# Altium schematic sheet Power_Regulators_RF_3.SchDoc
size A4; DocumentNumber: 37; SheetNumber: 37; SheetTotal: 47
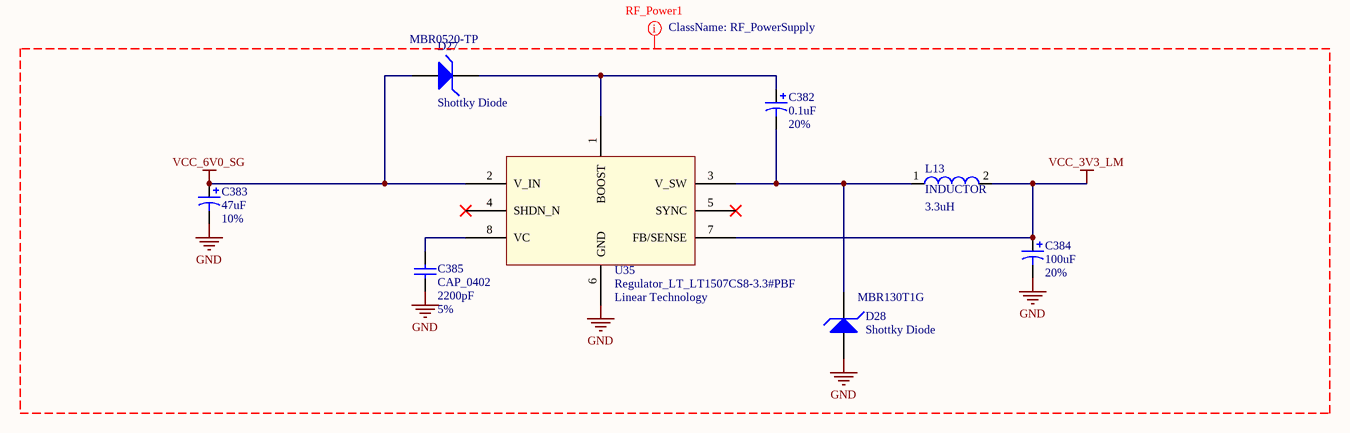
[diagram p0: Power_Regulators_RF_3.SchDoc]

## Parts
C382  value 0.1uF  Tolerance: 20%  [Polarized_CAPC1206(3216)]  (hidden comment: Cap Pol1)
C383  value 47uF  Tolerance: 10%  [Polarized_CAPC1210(3225)]  (hidden comment: Cap Pol1)
C384  value 100uF  Tolerance: 20%  [Polarized_CAPC1210(3225)]  (hidden comment: Cap Pol1)
C385  CAP_0402  value 2200pF  Tolerance: 5%  [CAPC0402(1005)60_N]
D27  Shottky Diode  Part Number: MBR0520-TP  [SchottkyDiode_MBR0520-TP_SOD-123]
D28  Shottky Diode  Part Number: MBR130T1G  [SchottkyDiode_MBR130T1G_SOD-123]
L13  INDUCTOR  value 3.3uH  [Inductor_IHSM4825ER_2-PIN]
U35  Regulator_LT_LT1507CS8-3.3#PBF  Manufacturer: Linear Technology  [Regulator_LT_LT1507CS8-3.3#PBF_8SOIC]

## Nets
GND: C383.2 C384.2 C385.1 D28.2(A) U35.6(GND)
VCC_3V3_LM: C384.1 L13.2 U35.7(FB/SENSE)
VCC_6V0_SG: C383.1 D27.2(A) U35.2(V_IN)
NetC382_1: C382.1 D27.1(K) U35.1(BOOST)
NetC382_2: C382.2 D28.1(K) L13.1 U35.3(V_SW)
NetC385_2: C385.2 U35.8(VC)

Not connected (* = marked no-connect by the designer): U35 4(SHDN_N)* 5(SYNC)*

## Layout directives
net class RF_PowerSupply: GND, VCC_3V3_LM, VCC_6V0_SG

## Library data of the parts
C382 = T491A104M035AT: CAP TANT 0.1UF 35V 20% 1206; Manufacturer: Kemet; Part Number: T491A104M035AT; Footprint Ref: Polarized_CAPC1206(3216); Library Ref: Cap Pol1
C383 = F951C476KBAAQ2: CAP TANT 47UF 16V 10% 1210; Manufacturer: Nichicon; Part Number: F951C476KBAAQ2; Footprint Ref: Polarized_CAPC1210(3225); Library Ref: Cap Pol1
C384 = TLCT107M010XTA: 100uF, tantalum, 20% 10V, 1210; Manufacturer: AVX Corporation; Part Number: TLCT107M010XTA; Footprint Ref: Polarized_CAPC1210(3225); Library Ref: Cap Pol1
C385 = C1005SL1A222J: CAP CER 2200PF 10V 5% SL 0402; Manufacturer: TDK Corporation; Part Number: C1005SL1A222J; Footprint Ref: CAPC0402(1005)60_N; Library Ref: CAP_0402
D27 = MBR0520-TP: DIODE SCHOTTKY 20V 500MA SOD123; Manufacturer: Micro Commercial Co; Footprint Ref: SchottkyDiode_MBR0520-TP_SOD-123; Library Ref: ShottkyDiode
D28 = MBR130T1G: DIODE SCHOTTKY 30V 1A SOD123; Manufacturer: ON Semiconductor; Footprint Ref: SchottkyDiode_MBR130T1G_SOD-123; Library Ref: ShottkyDiode
L13 = IHSM4825ER3R3L: INDUCTOR POWER 3.3UH 4.6A SMD; Manufacturer: Vishay Dale; Tolerance: *; Part Number: IHSM4825ER3R3L; Library Ref: INDUCTOR; Footprint Ref: Inductor_IHSM4825ER_2-PIN
U35 = LT1507CS8-3.3#PBF: IC REG BUCK 3.3V 1.5A 8SOIC; Part Number: LT1507CS8-3.3#PBF; Footprint Ref: Regulator_LT_LT1507CS8-3.3#PBF_8SOIC; Library Ref: Regulator_LT_LT1507CS8-3.3#PBF